# Altium schematic sheet Cross-LogIO.SchDoc
size A1; Organization: Protel International P/L; Address1: L3, 12a Rodborough Rd; Address2: Frenchs Forest; Address3: NSW; Address4: Australia 2086
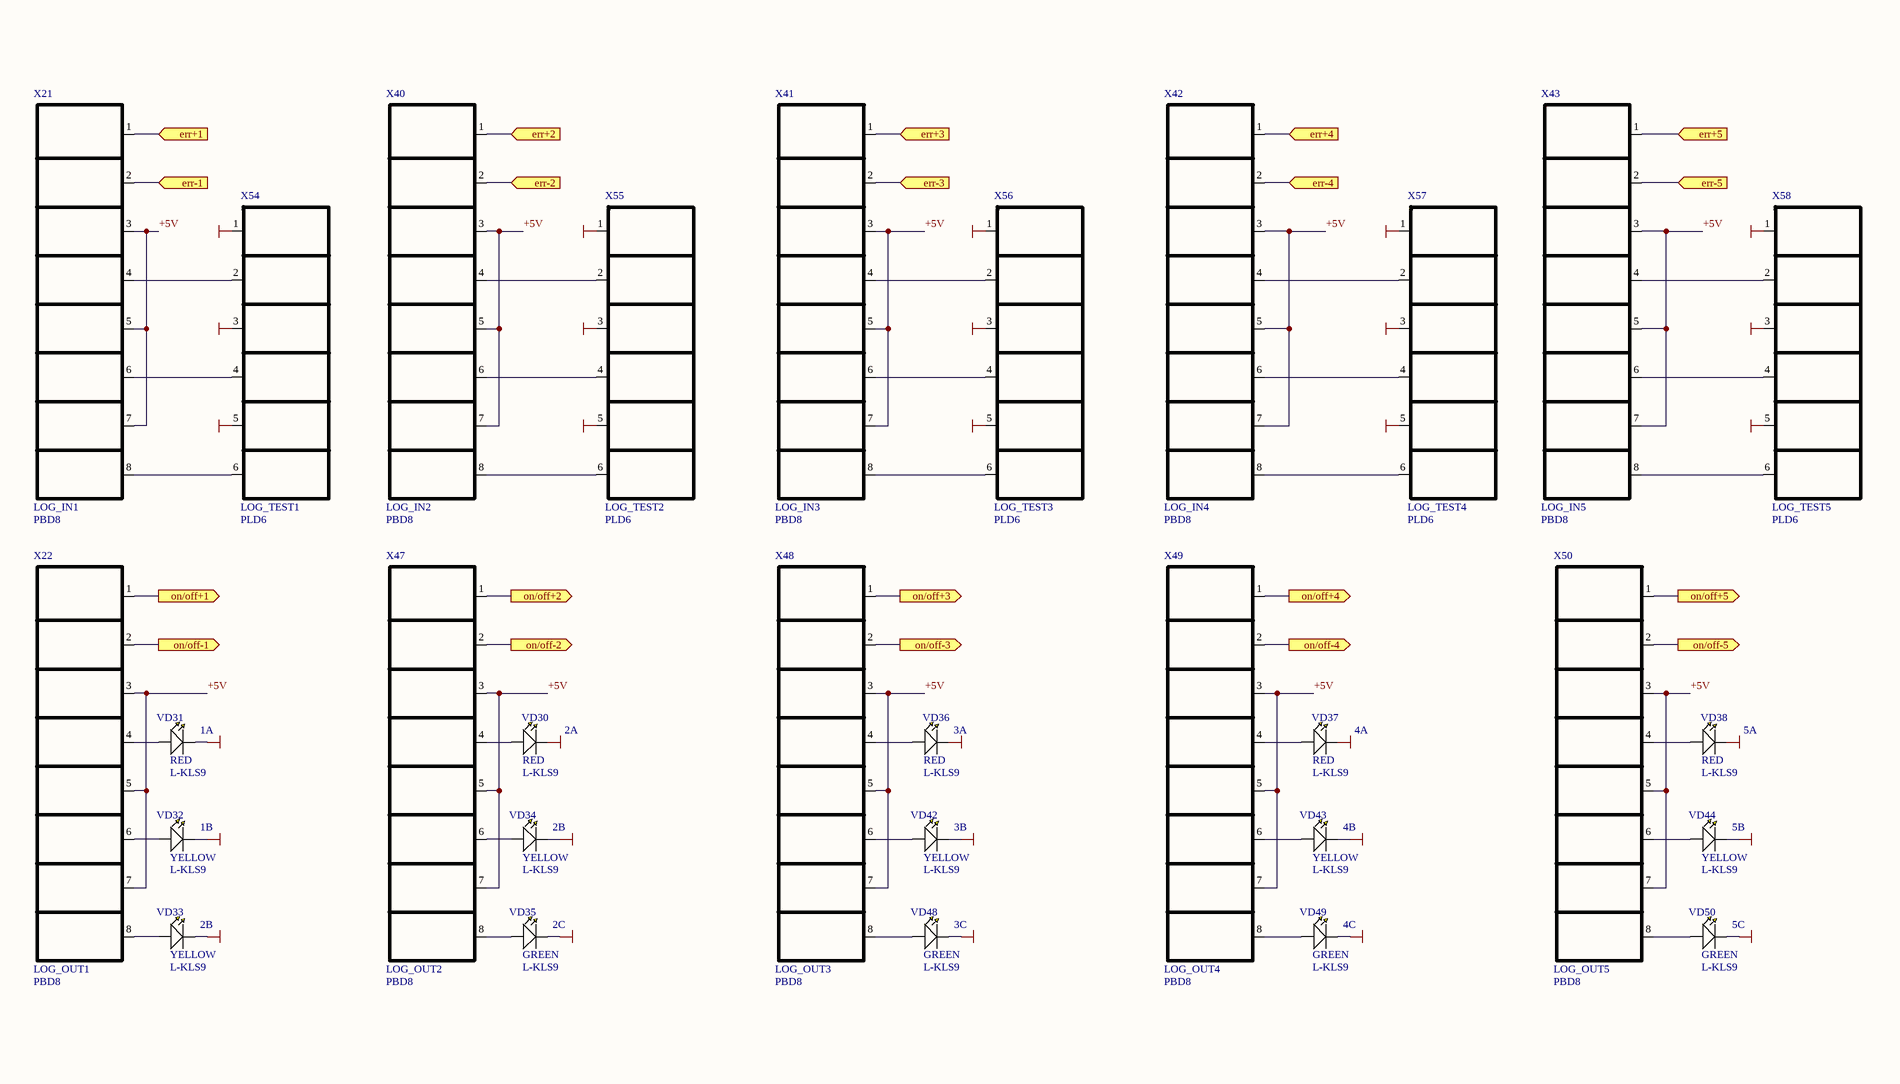
[diagram p0: Cross-LogIO.SchDoc, left]
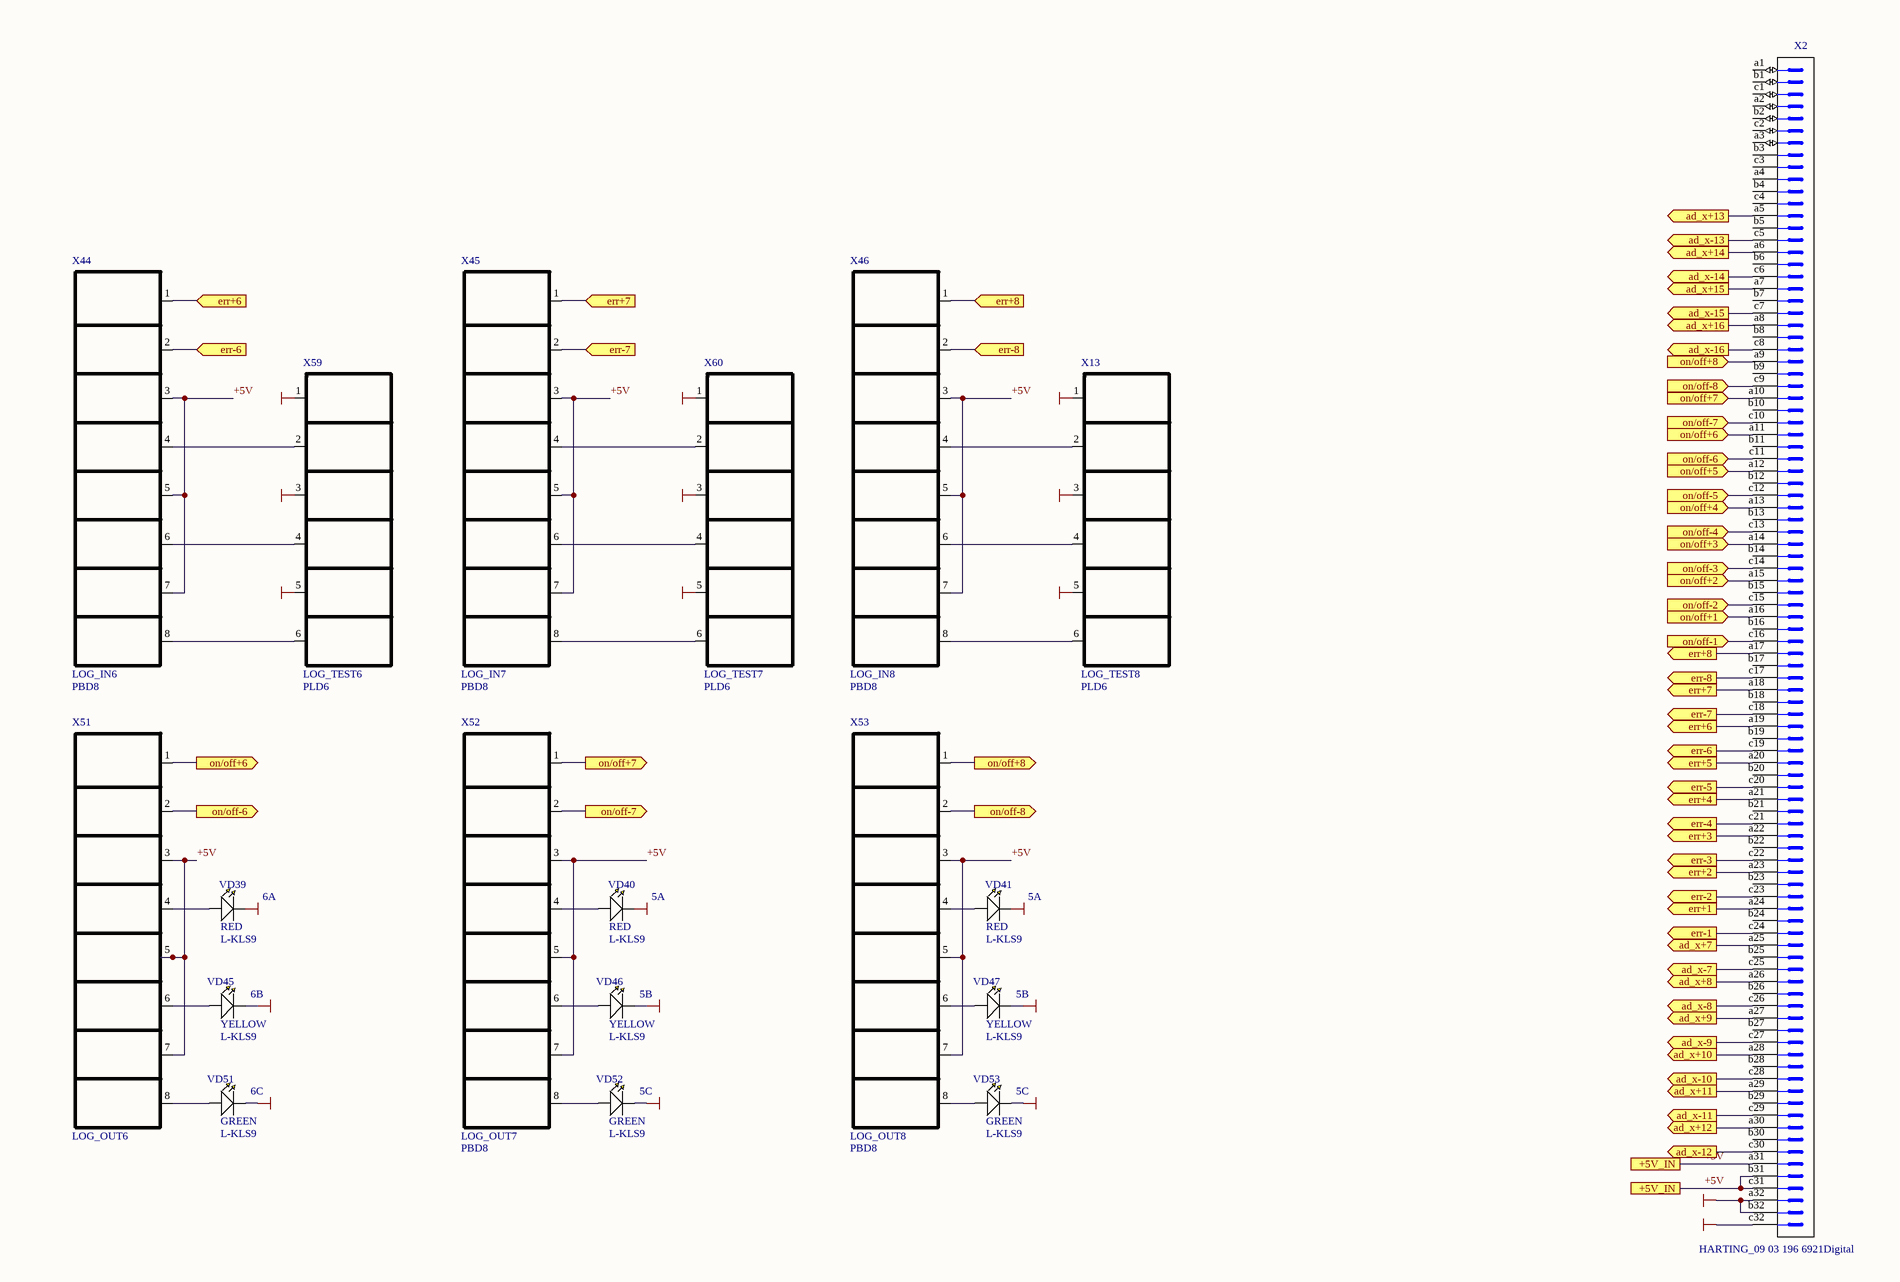
[diagram p1: Cross-LogIO.SchDoc, right]

## Parts
VD30  2A  Color: RED  Device: L-KLS9  [LED0603]
VD31  1A  Color: RED  Device: L-KLS9  [LED0603]
VD32  1B  Color: YELLOW  Device: L-KLS9  [LED0603]
VD33  2B  Color: YELLOW  Device: L-KLS9  [LED0603]
VD34  2B  Color: YELLOW  Device: L-KLS9  [LED0603]
VD35  2C  Color: GREEN  Device: L-KLS9  [LED0603]
VD36  3A  Color: RED  Device: L-KLS9  [LED0603]
VD37  4A  Color: RED  Device: L-KLS9  [LED0603]
VD38  5A  Color: RED  Device: L-KLS9  [LED0603]
VD39  6A  Color: RED  Device: L-KLS9  [LED0603]
VD40  5A  Color: RED  Device: L-KLS9  [LED0603]
VD41  5A  Color: RED  Device: L-KLS9  [LED0603]
VD42  3B  Color: YELLOW  Device: L-KLS9  [LED0603]
VD43  4B  Color: YELLOW  Device: L-KLS9  [LED0603]
VD44  5B  Color: YELLOW  Device: L-KLS9  [LED0603]
VD45  6B  Color: YELLOW  Device: L-KLS9  [LED0603]
VD46  5B  Color: YELLOW  Device: L-KLS9  [LED0603]
VD47  5B  Color: YELLOW  Device: L-KLS9  [LED0603]
VD48  3C  Color: GREEN  Device: L-KLS9  [LED0603]
VD49  4C  Color: GREEN  Device: L-KLS9  [LED0603]
VD50  5C  Color: GREEN  Device: L-KLS9  [LED0603]
VD51  6C  Color: GREEN  Device: L-KLS9  [LED0603]
VD52  5C  Color: GREEN  Device: L-KLS9  [LED0603]
VD53  5C  Color: GREEN  Device: L-KLS9  [LED0603]
X2  HARTING_09 03 196 6921Digital  [HARTING_09 03 196 6921]
X13  LOG_TEST8  [DIP_6-254_WO_CASE]
X21  LOG_IN1  [DIP_8-254_F]
X22  LOG_OUT1  [DIP_8-254_F]
X40  LOG_IN2  [DIP_8-254_F]
X41  LOG_IN3  [DIP_8-254_F]
X42  LOG_IN4  [DIP_8-254_F]
X43  LOG_IN5  [DIP_8-254_F]
X44  LOG_IN6  [DIP_8-254_F]
X45  LOG_IN7  [DIP_8-254_F]
X46  LOG_IN8  [DIP_8-254_F]
X47  LOG_OUT2  [DIP_8-254_F]
X48  LOG_OUT3  [DIP_8-254_F]
X49  LOG_OUT4  [DIP_8-254_F]
X50  LOG_OUT5  [DIP_8-254_F]
X51  LOG_OUT6  [DIP_8-254_F]
X52  LOG_OUT7  [DIP_8-254_F]
X53  LOG_OUT8  [DIP_8-254_F]
X54  LOG_TEST1  [DIP_6-254_WO_CASE]
X55  LOG_TEST2  [DIP_6-254_WO_CASE]
X56  LOG_TEST3  [DIP_6-254_WO_CASE]
X57  LOG_TEST4  [DIP_6-254_WO_CASE]
X58  LOG_TEST5  [DIP_6-254_WO_CASE]
X59  LOG_TEST6  [DIP_6-254_WO_CASE]
X60  LOG_TEST7  [DIP_6-254_WO_CASE]

## Ports
+5V_IN, ad_x+7 (out), ad_x+8 (out), ad_x+9 (out), ad_x+10 (out), ad_x+11 (out), ad_x+12 (out), ad_x+13 (out), ad_x+14 (out), ad_x+15 (out), ad_x+16 (out), ad_x-7 (out), ad_x-8 (out), ad_x-9 (out), ad_x-10 (out), ad_x-11 (out), ad_x-12 (out), ad_x-13 (out), ad_x-14 (out), ad_x-15 (out), ad_x-16 (out), err+1 (in), err+1 (out), err+2 (in), err+2 (out), err+3 (in), err+3 (out), err+4 (in), err+4 (out), err+5 (in), err+5 (out), err+6 (in), err+6 (out), err+7 (in), err+7 (out), err+8 (in), err+8 (out), err-1 (in), err-1 (out), err-2 (in), err-2 (out), err-3 (in), err-3 (out), err-4 (in), err-4 (out), err-5 (in), err-5 (out), err-6 (in), err-6 (out), err-7 (in), err-7 (out), err-8 (in), err-8 (out), on/off+1 (in), on/off+1 (out), on/off+2 (in), on/off+2 (out), on/off+3 (in), on/off+3 (out), on/off+4 (in), on/off+4 (out), on/off+5 (in), on/off+5 (out), on/off+6 (in), on/off+6 (out), on/off+7 (in), on/off+7 (out), on/off+8 (in), on/off+8 (out), on/off-1 (in), on/off-1 (out), on/off-2 (in), on/off-2 (out), on/off-3 (in), on/off-3 (out), on/off-4 (in), on/off-4 (out), on/off-5 (in), on/off-5 (out), on/off-6 (in), on/off-6 (out), on/off-7 (in), on/off-7 (out), on/off-8 (in), on/off-8 (out)

## Nets
GND: VD30.1(C) VD31.1(C) VD32.1(C) VD33.1(C) VD34.1(C) VD35.1(C) VD36.1(C) VD37.1(C) VD38.1(C) VD39.1(C) VD40.1(C) VD41.1(C) VD42.1(C) VD43.1(C) VD44.1(C) VD45.1(C) VD46.1(C) VD47.1(C) VD48.1(C) VD49.1(C) VD50.1(C) VD51.1(C) VD52.1(C) VD53.1(C) X2.a32 X2.b32 X2.c32 X13.1 X13.3 X13.5 X54.1 X54.3 X54.5 X55.1 X55.3 X55.5 X56.1 X56.3 X56.5 X57.1 X57.3 X57.5 X58.1 X58.3 X58.5 X59.1 X59.3 X59.5 X60.1 X60.3 X60.5
+5V: X2.a31 X2.b31 X2.c31 X21.3 X21.5 X21.7 X22.3 X22.5 X22.7 X40.3 X40.5 X40.7 X41.3 X41.5 X41.7 X42.3 X42.5 X42.7 X43.3 X43.5 X43.7 X44.3 X44.5 X44.7 X45.3 X45.5 X45.7 X46.3 X46.5 X46.7 X47.3 X47.5 X47.7 X48.3 X48.5 X48.7 X49.3 X49.5 X49.7 X50.3 X50.5 X50.7 X51.3 X51.5 X51.7 X52.3 X52.5 X52.7 X53.3 X53.5 X53.7 ; port +5V_IN
ad_x+7: X2.a25 ; port ad_x+7
ad_x+8: X2.a26 ; port ad_x+8
ad_x+9: X2.a27 ; port ad_x+9
ad_x+10: X2.a28 ; port ad_x+10
ad_x+11: X2.a29 ; port ad_x+11
ad_x+12: X2.a30 ; port ad_x+12
ad_x+13: X2.a5 ; port ad_x+13
ad_x+14: X2.a6 ; port ad_x+14
ad_x+15: X2.a7 ; port ad_x+15
ad_x+16: X2.a8 ; port ad_x+16
ad_x-7: X2.c25 ; port ad_x-7
ad_x-8: X2.c26 ; port ad_x-8
ad_x-9: X2.c27 ; port ad_x-9
ad_x-10: X2.c28 ; port ad_x-10
ad_x-11: X2.c29 ; port ad_x-11
ad_x-12: X2.c30 ; port ad_x-12
ad_x-13: X2.c5 ; port ad_x-13
ad_x-14: X2.c6 ; port ad_x-14
ad_x-15: X2.c7 ; port ad_x-15
ad_x-16: X2.c8 ; port ad_x-16
err+1: X2.a24 X21.1 ; port err+1
err+2: X2.a23 X40.1 ; port err+2
err+3: X2.a22 X41.1 ; port err+3
err+4: X2.a21 X42.1 ; port err+4
err+5: X2.a20 X43.1 ; port err+5
err+6: X2.a19 X44.1 ; port err+6
err+7: X2.a18 X45.1 ; port err+7
err+8: X2.a17 X46.1 ; port err+8
err-1: X2.c24 X21.2 ; port err-1
err-2: X2.c23 X40.2 ; port err-2
err-3: X2.c22 X41.2 ; port err-3
err-4: X2.c21 X42.2 ; port err-4
err-5: X2.c20 X43.2 ; port err-5
err-6: X2.c19 X44.2 ; port err-6
err-7: X2.c18 X45.2 ; port err-7
err-8: X2.c17 X46.2 ; port err-8
on/off+1: X2.a16 X22.1 ; port on/off+1
on/off+2: X2.a15 X47.1 ; port on/off+2
on/off+3: X2.a14 X48.1 ; port on/off+3
on/off+4: X2.a13 X49.1 ; port on/off+4
on/off+5: X2.a12 X50.1 ; port on/off+5
on/off+6: X2.a11 X51.1 ; port on/off+6
on/off+7: X2.a10 X52.1 ; port on/off+7
on/off+8: X2.a9 X53.1 ; port on/off+8
on/off-1: X2.c16 X22.2 ; port on/off-1
on/off-2: X2.c15 X47.2 ; port on/off-2
on/off-3: X2.c14 X48.2 ; port on/off-3
on/off-4: X2.c13 X49.2 ; port on/off-4
on/off-5: X2.c12 X50.2 ; port on/off-5
on/off-6: X2.c11 X51.2 ; port on/off-6
on/off-7: X2.c10 X52.2 ; port on/off-7
on/off-8: X2.c9 X53.2 ; port on/off-8
NetVD30_2: VD30.2(A) X47.4
NetVD31_2: VD31.2(A) X22.4
NetVD32_2: VD32.2(A) X22.6
NetVD33_2: VD33.2(A) X22.8
NetVD34_2: VD34.2(A) X47.6
NetVD35_2: VD35.2(A) X47.8
NetVD36_2: VD36.2(A) X48.4
NetVD37_2: VD37.2(A) X49.4
NetVD38_2: VD38.2(A) X50.4
NetVD39_2: VD39.2(A) X51.4
NetVD40_2: VD40.2(A) X52.4
NetVD41_2: VD41.2(A) X53.4
NetVD42_2: VD42.2(A) X48.6
NetVD43_2: VD43.2(A) X49.6
NetVD44_2: VD44.2(A) X50.6
NetVD45_2: VD45.2(A) X51.6
NetVD46_2: VD46.2(A) X52.6
NetVD47_2: VD47.2(A) X53.6
NetVD48_2: VD48.2(A) X48.8
NetVD49_2: VD49.2(A) X49.8
NetVD50_2: VD50.2(A) X50.8
NetVD51_2: VD51.2(A) X51.8
NetVD52_2: VD52.2(A) X52.8
NetVD53_2: VD53.2(A) X53.8
NetX13_2: X13.2 X46.4
NetX13_4: X13.4 X46.6
NetX13_6: X13.6 X46.8
NetX21_4: X21.4 X54.2
NetX21_6: X21.6 X54.4
NetX21_8: X21.8 X54.6
NetX40_4: X40.4 X55.2
NetX40_6: X40.6 X55.4
NetX40_8: X40.8 X55.6
NetX41_4: X41.4 X56.2
NetX41_6: X41.6 X56.4
NetX41_8: X41.8 X56.6
NetX42_4: X42.4 X57.2
NetX42_6: X42.6 X57.4
NetX42_8: X42.8 X57.6
NetX43_4: X43.4 X58.2
NetX43_6: X43.6 X58.4
NetX43_8: X43.8 X58.6
NetX44_4: X44.4 X59.2
NetX44_6: X44.6 X59.4
NetX44_8: X44.8 X59.6
NetX45_4: X45.4 X60.2
NetX45_6: X45.6 X60.4
NetX45_8: X45.8 X60.6

Not connected (* = marked no-connect by the designer): X2 a1 a2 a3 a4 b1 b2(5) b3 b4 b5 b6 b7 b8 b9 b10 b11 b12 b13 b14 b15 b16 b17 b18 b19 b20 b21 b22 b23 b24 b25 b26 b27 b28 b29 b30 c1 c2 c3 c4

## Notes on the sheet
- Title
- Size:
- Date:
- File:
- A1
- Number:
- Time:
- Revision:
- Sheet
- of

## Library data of the parts
VD30-VD53 = L-KLS9-T0603: Chip LED SMD 0603; Vendor: NINGBO KLS ELECTRONIC CO LTD; Package: SMD0603; Unit Price: 0.1
  VD30: Value: 2A
  VD31: Value: 1A
  VD32: Value: 1B
  VD33 VD34: Value: 2B
  VD35: Value: 2C
  VD36: Value: 3A
  VD37: Value: 4A
  VD38 VD40 VD41: Value: 5A
  VD39: Value: 6A
  VD42: Value: 3B
  VD43: Value: 4B
  VD44 VD46 VD47: Value: 5B
  VD45: Value: 6B
  VD48: Value: 3C
  VD49: Value: 4C
  VD50 VD52 VD53: Value: 5C
  VD51: Value: 6C
X2 = HARTING_09 03 196 6921: Connector 96 Male Right Angle; Vendor: HARTING; Unit Price: 6; Device: HARTING_09 03 196 6921; Value: Digital
X13 X54-X60 = PLD6: 6 pin TRH connector 2.54mm pitch; Vendor: Connfly; Pckage: DIP6- 2.54; Unit Price: 0.2; Device: PLD6
  X13: Value: LOG_TEST8
  X54: Value: LOG_TEST1
  X55: Value: LOG_TEST2
  X56: Value: LOG_TEST3
  X57: Value: LOG_TEST4
  X58: Value: LOG_TEST5
  X59: Value: LOG_TEST6
  X60: Value: LOG_TEST7
X21 X22 X40-X53 = PBD8: 8 pin TRH socket 2.54mm pitch; Vendor: Connfly; Pckage: DIP8- 2.54; Unit Price: 0.2
  X21: Value: LOG_IN1; Device: PBD8
  X22: Value: LOG_OUT1; Device: PBD8
  X40: Value: LOG_IN2; Device: PBD8
  X41: Value: LOG_IN3; Device: PBD8
  X42: Value: LOG_IN4; Device: PBD8
  X43: Value: LOG_IN5; Device: PBD8
  X44: Value: LOG_IN6; Device: PBD8
  X45: Value: LOG_IN7; Device: PBD8
  X46: Value: LOG_IN8; Device: PBD8
  X47: Value: LOG_OUT2; Device: PBD8
  X48: Value: LOG_OUT3; Device: PBD8
  X49: Value: LOG_OUT4; Device: PBD8
  X50: Value: LOG_OUT5; Device: PBD8
  X51: Value: LOG_OUT6
  X52: Value: LOG_OUT7; Device: PBD8
  X53: Value: LOG_OUT8; Device: PBD8